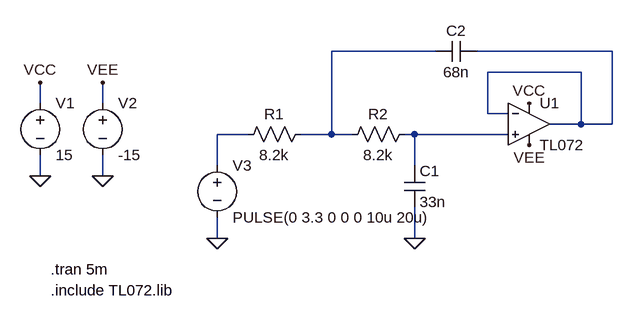
[diagram p0: schematic pwm-sallen-key-offsetasc.asc]
pwm-sallen-key-offsetasc.asc, the LTspice schematic file:
Version 4.1
SHEET 1 900 680
WIRE 624 -32 464 -32
WIRE 896 -32 688 -32
WIRE 848 0 704 0
WIRE 16 48 16 16
WIRE 112 48 112 16
WIRE 704 64 704 0
WIRE 736 64 704 64
WIRE 848 80 848 0
WIRE 848 80 800 80
WIRE 896 80 896 -32
WIRE 896 80 848 80
WIRE 336 96 288 96
WIRE 464 96 464 -32
WIRE 464 96 416 96
WIRE 496 96 464 96
WIRE 592 96 576 96
WIRE 736 96 592 96
WIRE 288 144 288 96
WIRE 592 144 592 96
WIRE 16 160 16 128
WIRE 112 160 112 128
WIRE 288 256 288 224
WIRE 592 256 592 208
FLAG 16 160 0
FLAG 112 160 0
FLAG 16 16 VCC
FLAG 112 16 VEE
FLAG 288 256 0
FLAG 592 256 0
FLAG 768 48 VCC
FLAG 768 112 VEE
SYMBOL voltage 16 32 R0
WINDOW 123 0 0 Left 0
WINDOW 39 0 0 Left 0
SYMATTR InstName V1
SYMATTR Value 15
SYMBOL voltage 112 32 R0
WINDOW 123 0 0 Left 0
WINDOW 39 0 0 Left 0
SYMATTR InstName V2
SYMATTR Value -15
SYMBOL voltage 288 128 R0
WINDOW 123 0 0 Left 0
WINDOW 39 0 0 Left 0
SYMATTR InstName V3
SYMATTR Value PULSE(0 3.3 0 0 0 10u 20u)
SYMBOL OpAmps\\opamp2 768 16 R0
SYMATTR InstName U1
SYMATTR Value TL072
SYMBOL res 432 80 R90
WINDOW 0 0 56 VBottom 2
WINDOW 3 32 56 VTop 2
SYMATTR InstName R1
SYMATTR Value 8.2k
SYMBOL res 592 80 R90
WINDOW 0 0 56 VBottom 2
WINDOW 3 32 56 VTop 2
SYMATTR InstName R2
SYMATTR Value 8.2k
SYMBOL cap 576 144 R0
SYMATTR InstName C1
SYMATTR Value 33n
SYMBOL cap 688 -48 R90
WINDOW 0 0 32 VBottom 2
WINDOW 3 32 32 VTop 2
SYMATTR InstName C2
SYMATTR Value 68n
TEXT 32 304 Left 2 !.tran 5m
TEXT 32 336 Left 2 !.include TL072.lib

The netlist it stands for:
* pwm-sallen-key-offsetasc.asc
V1 VCC 0 15
V2 VEE 0 -15
V3 N003 0 PULSE(0 3.3 0 0 0 10u 20u)
X§U1 N004 N002 VCC VEE N002 TL072  ; pins In+ In- V+ V- OUT
R1 N001 N003 8.2k
R2 N004 N001 8.2k
C1 N004 0 33n
C2 N002 N001 68n
.tran 5m
.include TL072.lib
.backanno
.end